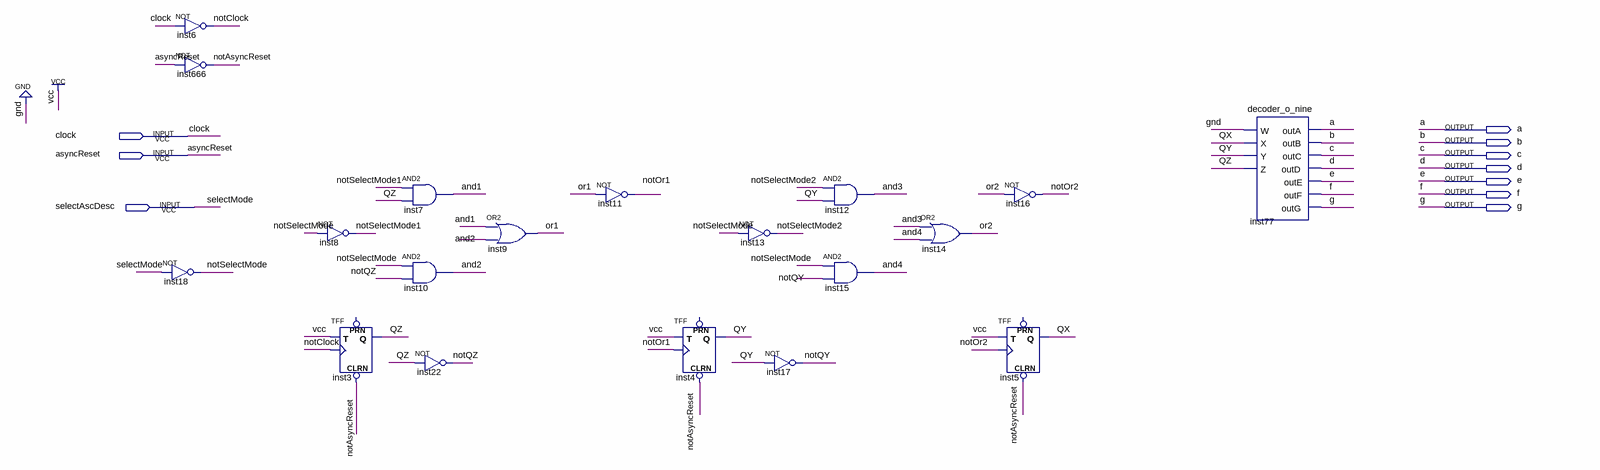
[diagram p0: schematic sheet]
// Quartus schematic desc_asc_async_counter.bdf as structural Verilog: 19 symbols, 10 pins
module desc_asc_async_counter (
  input  clock,
  input  asyncReset,
  input  selectAscDesc,
  output a,
  output b,
  output c,
  output d,
  output e,
  output f,
  output g
);

  wire and1, and2, and3, and4, notAsyncReset, notClock, notOr1, notOr2, notQY, notQZ, notSelectMode,
       notSelectMode1, notSelectMode2, or1, or2, QX, QY, QZ;

  not inst6 (notClock, clock);
  not inst666 (notAsyncReset, asyncReset);
  not inst18 (notSelectMode, selectAscDesc);
  not inst8 (notSelectMode1, notSelectMode);
  TFF inst3 (.CLRN(notAsyncReset), .T(1'b1), .CLK(notClock), .Q(QZ));  // open: PRN
  and inst7 (and1, notSelectMode1, QZ);
  and inst10 (and2, notSelectMode, notQZ);
  not inst22 (notQZ, QZ);
  or inst9 (or1, and1, and2);
  not inst11 (notOr1, or1);
  TFF inst4 (.CLRN(notAsyncReset), .T(1'b1), .CLK(notOr1), .Q(QY));  // open: PRN
  not inst13 (notSelectMode2, notSelectMode);
  not inst17 (notQY, QY);
  and inst12 (and3, notSelectMode2, QY);
  and inst15 (and4, notSelectMode, notQY);
  or inst14 (or2, and3, and4);
  not inst16 (notOr2, or2);
  TFF inst5 (.CLRN(notAsyncReset), .T(1'b1), .CLK(notOr2), .Q(QX));  // open: PRN
  decoder_o_nine inst77 (
    .W(1'b0), .X(QX), .Y(QY), .Z(QZ), .outA(a), .outB(b), .outC(c), .outD(d), .outE(e), .outF(f), .outG(g));

  // Other names for the same wires on the sheet: selectMode = selectAscDesc
endmodule
